# Altium schematic sheet Connectors.SchDoc
size 594 x 420 mm; PageSetup: Record=PageOptions|CenterHorizontal=True|CenterVertical=True|PrintScale=0.94|XCorrection=1.00|YCorrection=1.00|PrintKind=1|BorderSize=5000000|LeftOffset=0|BottomOffset=0|Orientation=1|PaperLength=1000|PaperWidth=1000|Scale=100|PaperSource=7|PrintQuality=-4|MediaType=1|DitherType=10|PaperKind=A4|PrintScaleMode=1; Address1: Address1; Address2: Address2; Address3: Address3; Address4: Address4; DocumentNumber: 5; SheetNumber: 5; SheetTotal: 5
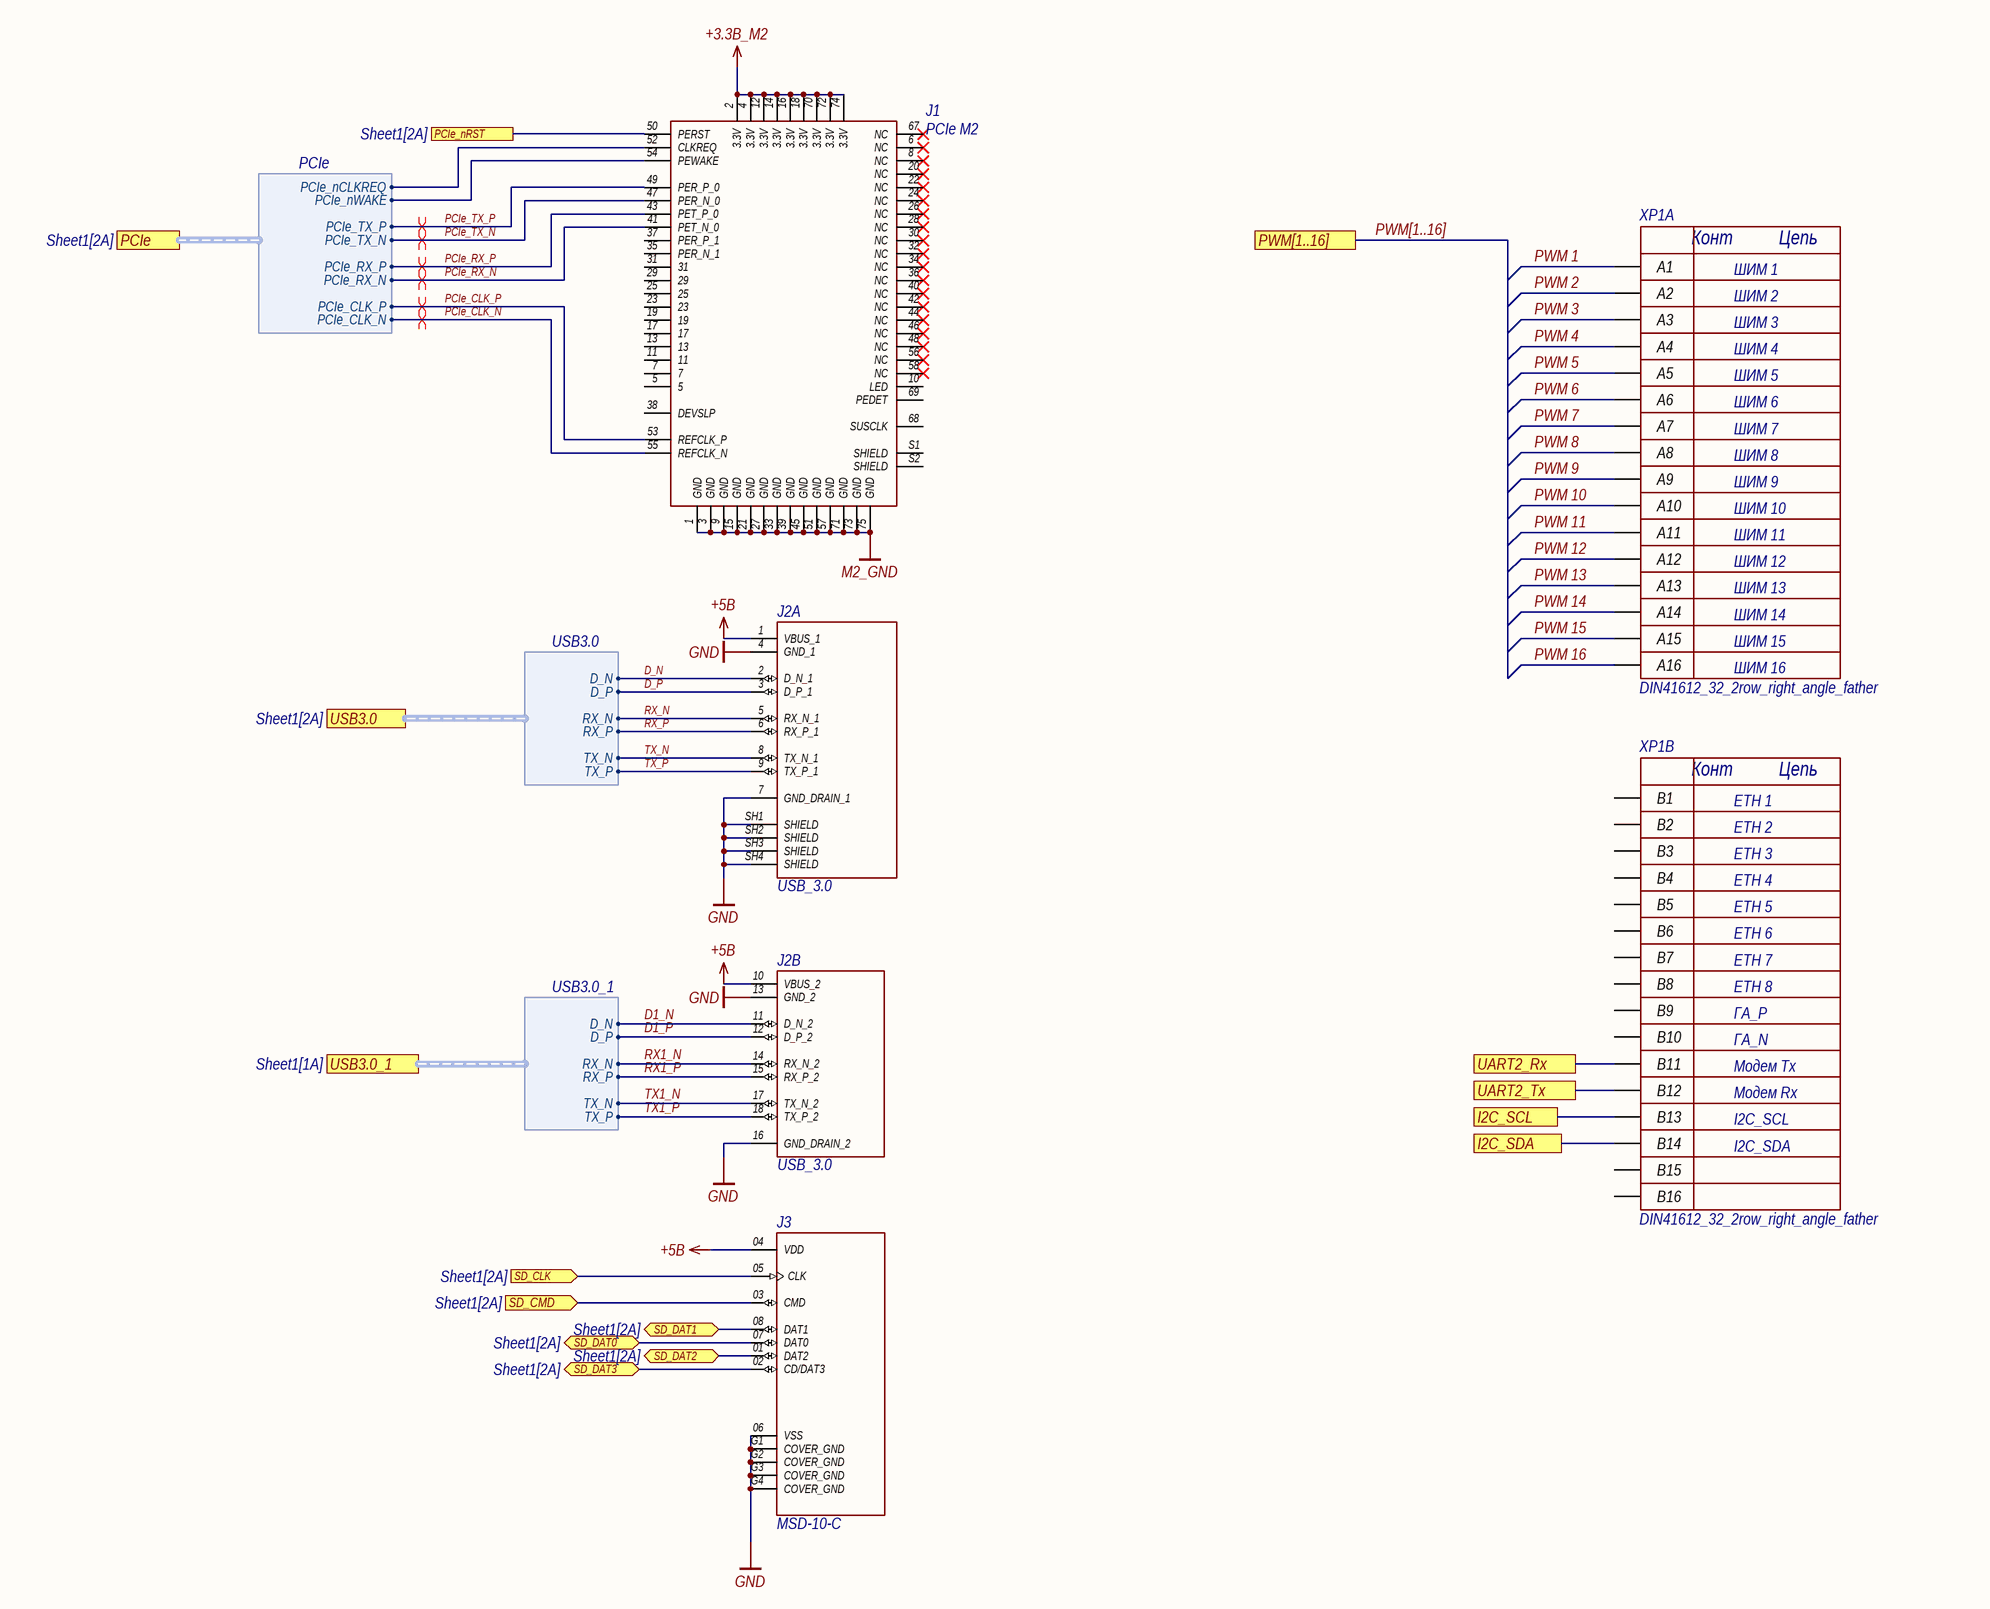
[diagram p0: Connectors.SchDoc]

## Parts
J1  PCIe M2  [PCIe M2]
J2  USB_3.0  [USB_3.0]  (parts A,B of 2)
J3  MSD-10-C  [CUI_MSD-10-C]
XP1  DIN41612_32_2row_right_angle_father  [DIN41612_32_2row_right_angle_father]  (parts A,B of 2)

## Ports
I2C_SCL, I2C_SDA, PCIe (harness PCIe, see Sheet1[2A]), PCIe_nRST (see Sheet1[2A]), PWM[1..16], SD_CLK (in, see Sheet1[2A]), SD_CMD (in, see Sheet1[2A]), SD_DAT0 (bidir, see Sheet1[2A]), SD_DAT1 (bidir, see Sheet1[2A]), SD_DAT2 (bidir, see Sheet1[2A]), SD_DAT3 (bidir, see Sheet1[2A]), UART2_Rx, UART2_Tx, USB3.0 (harness USB3.0, see Sheet1[2A]), USB3.0_1 (harness USB3.0_1, see Sheet1[1A])

## Harnesses
USB3.0: RX_N, RX_P, D_P, D_N, TX_N, TX_P
PCIe: PCIe_nCLKREQ, PCIe_nWAKE, PCIe_CLK_P, PCIe_CLK_N, PCIe_RX_P, PCIe_RX_N, PCIe_TX_P, PCIe_TX_N
USB3.0_1: RX_N, RX_P, D_P, D_N, TX_N, TX_P

## Nets
+3.3В_M2: J1.2(3.3V) J1.4(3.3V) J1.12(3.3V) J1.14(3.3V) J1.16(3.3V) J1.18(3.3V) J1.70(3.3V) J1.72(3.3V) J1.74(3.3V)
+5В: J2.1(VBUS_1) J2.10(VBUS_2) J3.04(VDD)
GND: J2.4(GND_1) J2.7(GND_DRAIN_1) J2.13(GND_2) J2.16(GND_DRAIN_2) J2.SH1(SHIELD) J2.SH2(SHIELD) J2.SH3(SHIELD) J2.SH4(SHIELD) J3.06(VSS) J3.G1(COVER_GND) J3.G2(COVER_GND) J3.G3(COVER_GND) J3.G4(COVER_GND)
M2_GND: J1.1(GND) J1.3(GND) J1.9(GND) J1.15(GND) J1.21(GND) J1.27(GND) J1.33(GND) J1.39(GND) J1.45(GND) J1.51(GND) J1.57(GND) J1.71(GND) J1.73(GND) J1.75(GND)
D1_N: J2.11(D_N_2) ; port USB3.0_1.D_N
D1_P: J2.12(D_P_2) ; port USB3.0_1.D_P
D_N: J2.2(D_N_1) ; port USB3.0.D_N
D_P: J2.3(D_P_1) ; port USB3.0.D_P
I2C_SCL: XP1.B13 ; port I2C_SCL
I2C_SDA: XP1.B14 ; port I2C_SDA
PCIe_CLK_N: J1.55(REFCLK_N) ; port PCIe.PCIe_CLK_N
PCIe_CLK_P: J1.53(REFCLK_P) ; port PCIe.PCIe_CLK_P
PCIe_nRST: J1.50(PERST) ; port PCIe_nRST
PCIe_RX_N: J1.41(PET_N_0) ; port PCIe.PCIe_RX_N
PCIe_RX_P: J1.43(PET_P_0) ; port PCIe.PCIe_RX_P
PCIe_TX_N: J1.47(PER_N_0) ; port PCIe.PCIe_TX_N
PCIe_TX_P: J1.49(PER_P_0) ; port PCIe.PCIe_TX_P
PWM 1: XP1.A1
PWM 2: XP1.A2
PWM 3: XP1.A3
PWM 4: XP1.A4
PWM 5: XP1.A5
PWM 6: XP1.A6
PWM 7: XP1.A7
PWM 8: XP1.A8
PWM 9: XP1.A9
PWM 10: XP1.A10
PWM 11: XP1.A11
PWM 12: XP1.A12
PWM 13: XP1.A13
PWM 14: XP1.A14
PWM 15: XP1.A15
PWM 16: XP1.A16
RX1_N: J2.14(RX_N_2) ; port USB3.0_1.RX_N
RX1_P: J2.15(RX_P_2) ; port USB3.0_1.RX_P
RX_N: J2.5(RX_N_1) ; port USB3.0.RX_N
RX_P: J2.6(RX_P_1) ; port USB3.0.RX_P
SD_CLK: J3.05(CLK) ; port SD_CLK
SD_CMD: J3.03(CMD) ; port SD_CMD
SD_DAT0: J3.07(DAT0) ; port SD_DAT0
SD_DAT1: J3.08(DAT1) ; port SD_DAT1
SD_DAT2: J3.01(DAT2) ; port SD_DAT2
SD_DAT3: J3.02(CD/DAT3) ; port SD_DAT3
TX1_N: J2.17(TX_N_2) ; port USB3.0_1.TX_N
TX1_P: J2.18(TX_P_2) ; port USB3.0_1.TX_P
TX_N: J2.8(TX_N_1) ; port USB3.0.TX_N
TX_P: J2.9(TX_P_1) ; port USB3.0.TX_P
UART2_Rx: XP1.B11 ; port UART2_Rx
UART2_Tx: XP1.B12 ; port UART2_Tx
NetJ1_52: J1.52(CLKREQ) ; port PCIe.PCIe_nCLKREQ
NetJ1_54: J1.54(PEWAKE) ; port PCIe.PCIe_nWAKE

Not connected (* = marked no-connect by the designer): J1 5 6(NC)* 7 8(NC)* 10(LED) 11 13 17 19 20(NC)* 22(NC)* 23 24(NC)* 25 26(NC)* 28(NC)* 29 30(NC)* 31 32(NC)* 34(NC)* 35(PER_N_1) 36(NC)* 37(PER_P_1) 38(DEVSLP) 40(NC)* 42(NC)* 44(NC)* 46(NC)* 48(NC)* 56(NC)* 58(NC)* 67(NC)* 68(SUSCLK) 69(PEDET) S1(SHIELD) S2(SHIELD); XP1 B1 B2 B3 B4 B5 B6 B7 B8 B9 B10 B15 B16

## Buses and harness runs
bus PWM[1..16] = port PWM[1..16]

## Layout directives
differential pair: PCIe_CLK_N, PCIe_CLK_P, PCIe_RX_N, PCIe_RX_P, PCIe_TX_N, PCIe_TX_P

## Notes on the sheet
- ШИМ 1
- ШИМ 2
- ШИМ 3
- ШИМ 4
- ШИМ 5
- ШИМ 6
- ШИМ 7
- ШИМ 8
- ШИМ 9
- ШИМ 10
- ШИМ 11
- ШИМ 12
- ШИМ 13
- ШИМ 14
- ШИМ 15
- ШИМ 16
- ETH 1
- ETH 2
- ETH 3
- ETH 4
- ETH 5
- ETH 6
- ETH 7
- ETH 8
- ГА_P
- ГА_N
- Модем Tx
- Модем Rx
- I2C_SCL
- I2C_SDA
- Перв. примен.
- Справ. №
- Подп. и дата
- Инв. № дубл.
- Взам. инв. №
- Инв. № подл.
- Изм.
- Лист
- № докум.
- Подп.
- Дата
- Копировал
- Формат А2
- (in symbol DIN41612_32_2row_right_angle_father, part A) Конт; Цепь
- (in symbol DIN41612_32_2row_right_angle_father, part B) Конт; Цепь

## Library data of the parts
J1 = PCIe M2: PCIe M.2 Connectors, Storage and Server Connector, P=0.5mm, H=3.2mm, Key M,Gold Plating; MF: Amphenol; MP: MDT320M03001; SnapEDA_Link: https://www.snapeda.com/parts/MDT320M03001/Amphenol/view-part/?ref=snap; Package: None; Value: *; Check_prices: https://www.snapeda.com/parts/MDT320M03001/Amphenol/view-part/?ref=eda; Part Number: PCIe M2
J2 = USB_3.0: Двойной USB 3.0; MF: Stewart Connector; MP: SS-52000-003; SnapEDA_Link: https://www.snapeda.com/parts/SS-52000-003/Stewart+Connector/view-part/?ref=snap; Package: None; Value: *; Check_prices: https://www.snapeda.com/parts/SS-52000-003/Stewart+Connector/view-part/?ref=eda; Part Number: USB_3.0
J3 = MSD-10-C: å¾®åž‹ SD å¡è¿žæŽ¥å™¨ï¼Œ 8 ä½ï¼Œ è¿žæŽ¥å™¨ï¼Œ é“°é“¾å¼ï¼Œ è¡¨é¢è´´è£…ï¼Œ æ¿ä¸Šæ–¹ 1.9 mm é«˜åº¦ï¼Œ 15uâ€œé‡‘; MF: Same Sky; SnapEDA_Link: https://www.snapeda.com/parts/MSD-10-C/Same+Sky/view-part/?ref=snap; Package: None; Value: *; MP: MSD-10-C; Check_prices: https://www.snapeda.com/parts/MSD-10-C/Same+Sky/view-part/?ref=eda
XP1 = DIN41612_32_2row_right_angle_father: DIN41612R (DS1118-32M0R23), Разъем (вилка) тип B 32pin (2х16), шаг 2.54мм двухрядный угловой (ряд АВ); Part Number: DIN41612_32_2row_right_angle_father